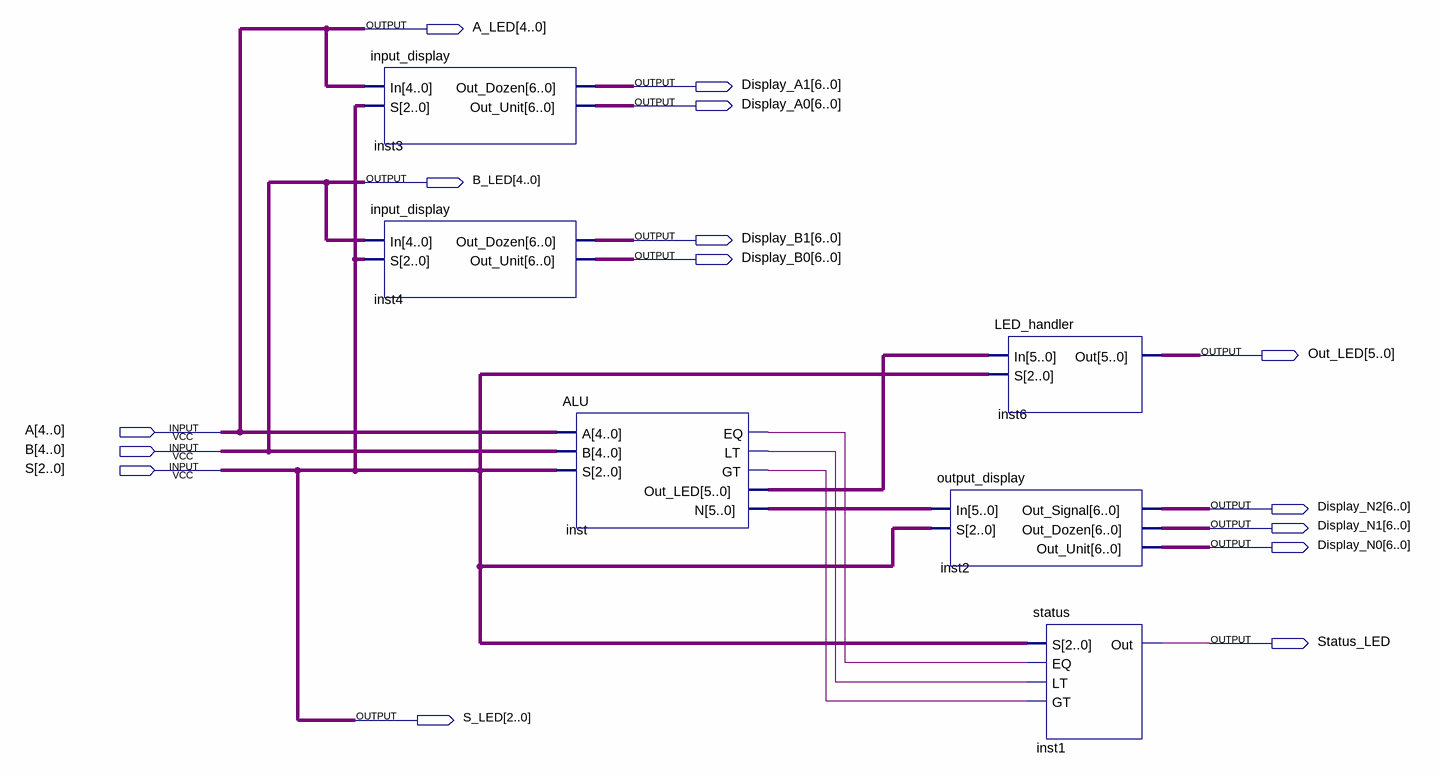
[diagram p0: schematic sheet]
// Quartus schematic ALU_FPGA.bdf as structural Verilog: 6 symbols, 15 pins
module ALU_FPGA (
  input  [4:0] A,
  input  [4:0] B,
  input  [2:0] S,
  output [4:0] A_LED,
  output [6:0] Display_A1,
  output [6:0] Display_A0,
  output [4:0] B_LED,
  output [6:0] Display_B1,
  output [6:0] Display_B0,
  output [5:0] Out_LED,
  output [6:0] Display_N2,
  output [6:0] Display_N1,
  output [6:0] Display_N0,
  output Status_LED,
  output [2:0] S_LED
);

  wire inst_eq, inst_gt, inst_lt;
  wire [5:0] inst_n, inst_out_led;

  input_display inst3 (.In(A), .S(S), .Out_Dozen(Display_A1), .Out_Unit(Display_A0));
  input_display inst4 (.In(B), .S(S), .Out_Dozen(Display_B1), .Out_Unit(Display_B0));
  ALU inst (.A(A), .B(B), .S(S), .EQ(inst_eq), .LT(inst_lt), .GT(inst_gt), .Out_LED(inst_out_led), .N(inst_n));
  LED_handler inst6 (.In(inst_out_led), .S(S), .Out(Out_LED));
  output_display inst2 (.In(inst_n), .S(S), .Out_Signal(Display_N2), .Out_Dozen(Display_N1), .Out_Unit(Display_N0));
  status inst1 (.S(S), .EQ(inst_eq), .LT(inst_lt), .GT(inst_gt), .Out(Status_LED));

  assign A_LED = A;
  assign B_LED = B;
  assign S_LED = S;
endmodule
